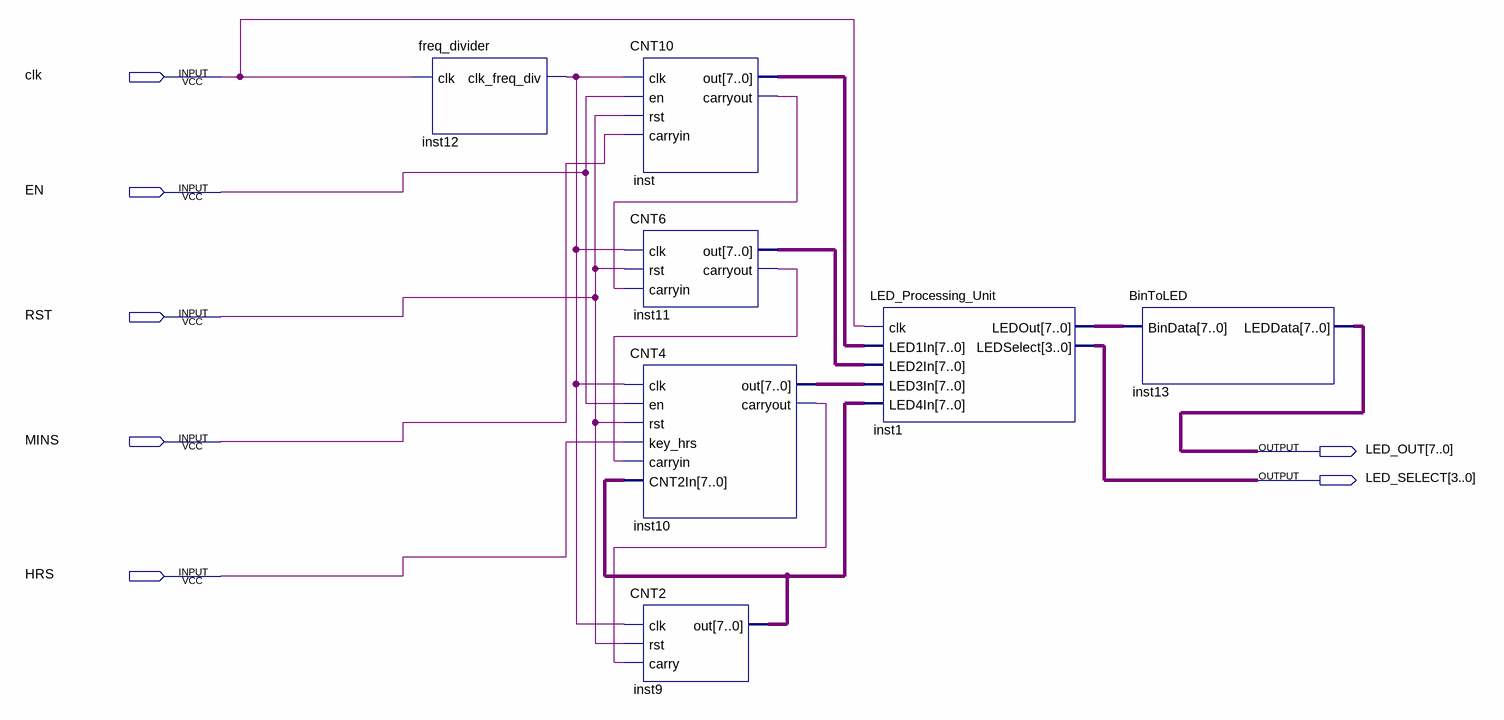
[diagram p0: schematic sheet]
// Quartus schematic Digital_clock.bdf as structural Verilog: 7 symbols, 7 pins
module Digital_clock (
  input  clk,
  input  EN,
  input  RST,
  input  MINS,
  input  HRS,
  output [7:0] LED_OUT,
  output [3:0] LED_SELECT
);

  wire inst10_carryout, inst11_carryout, inst12_clk_freq_div, inst_carryout;
  wire [7:0] inst1_ledout, inst9_out, inst10_out, inst11_out, inst_out;

  freq_divider inst12 (.clk(clk), .clk_freq_div(inst12_clk_freq_div));
  CNT10 inst (.clk(inst12_clk_freq_div), .en(EN), .rst(RST), .carryin(MINS), .out(inst_out), .carryout(inst_carryout));
  CNT6 inst11 (
    .clk(inst12_clk_freq_div), .rst(RST), .carryin(inst_carryout), .out(inst11_out),
    .carryout(inst11_carryout));
  CNT4 inst10 (
    .clk(inst12_clk_freq_div), .en(EN), .rst(RST), .key_hrs(HRS), .carryin(inst11_carryout),
    .CNT2In(inst9_out), .out(inst10_out), .carryout(inst10_carryout));
  CNT2 inst9 (.clk(inst12_clk_freq_div), .rst(RST), .carry(inst10_carryout), .out(inst9_out));
  LED_Processing_Unit inst1 (
    .clk(clk), .LED1In(inst_out), .LED2In(inst11_out), .LED3In(inst10_out), .LED4In(inst9_out),
    .LEDOut(inst1_ledout), .LEDSelect(LED_SELECT));
  BinToLED inst13 (.BinData(inst1_ledout), .LEDData(LED_OUT));
endmodule
